# EAGLE design audio_amp (EAGLE 9.1.3)
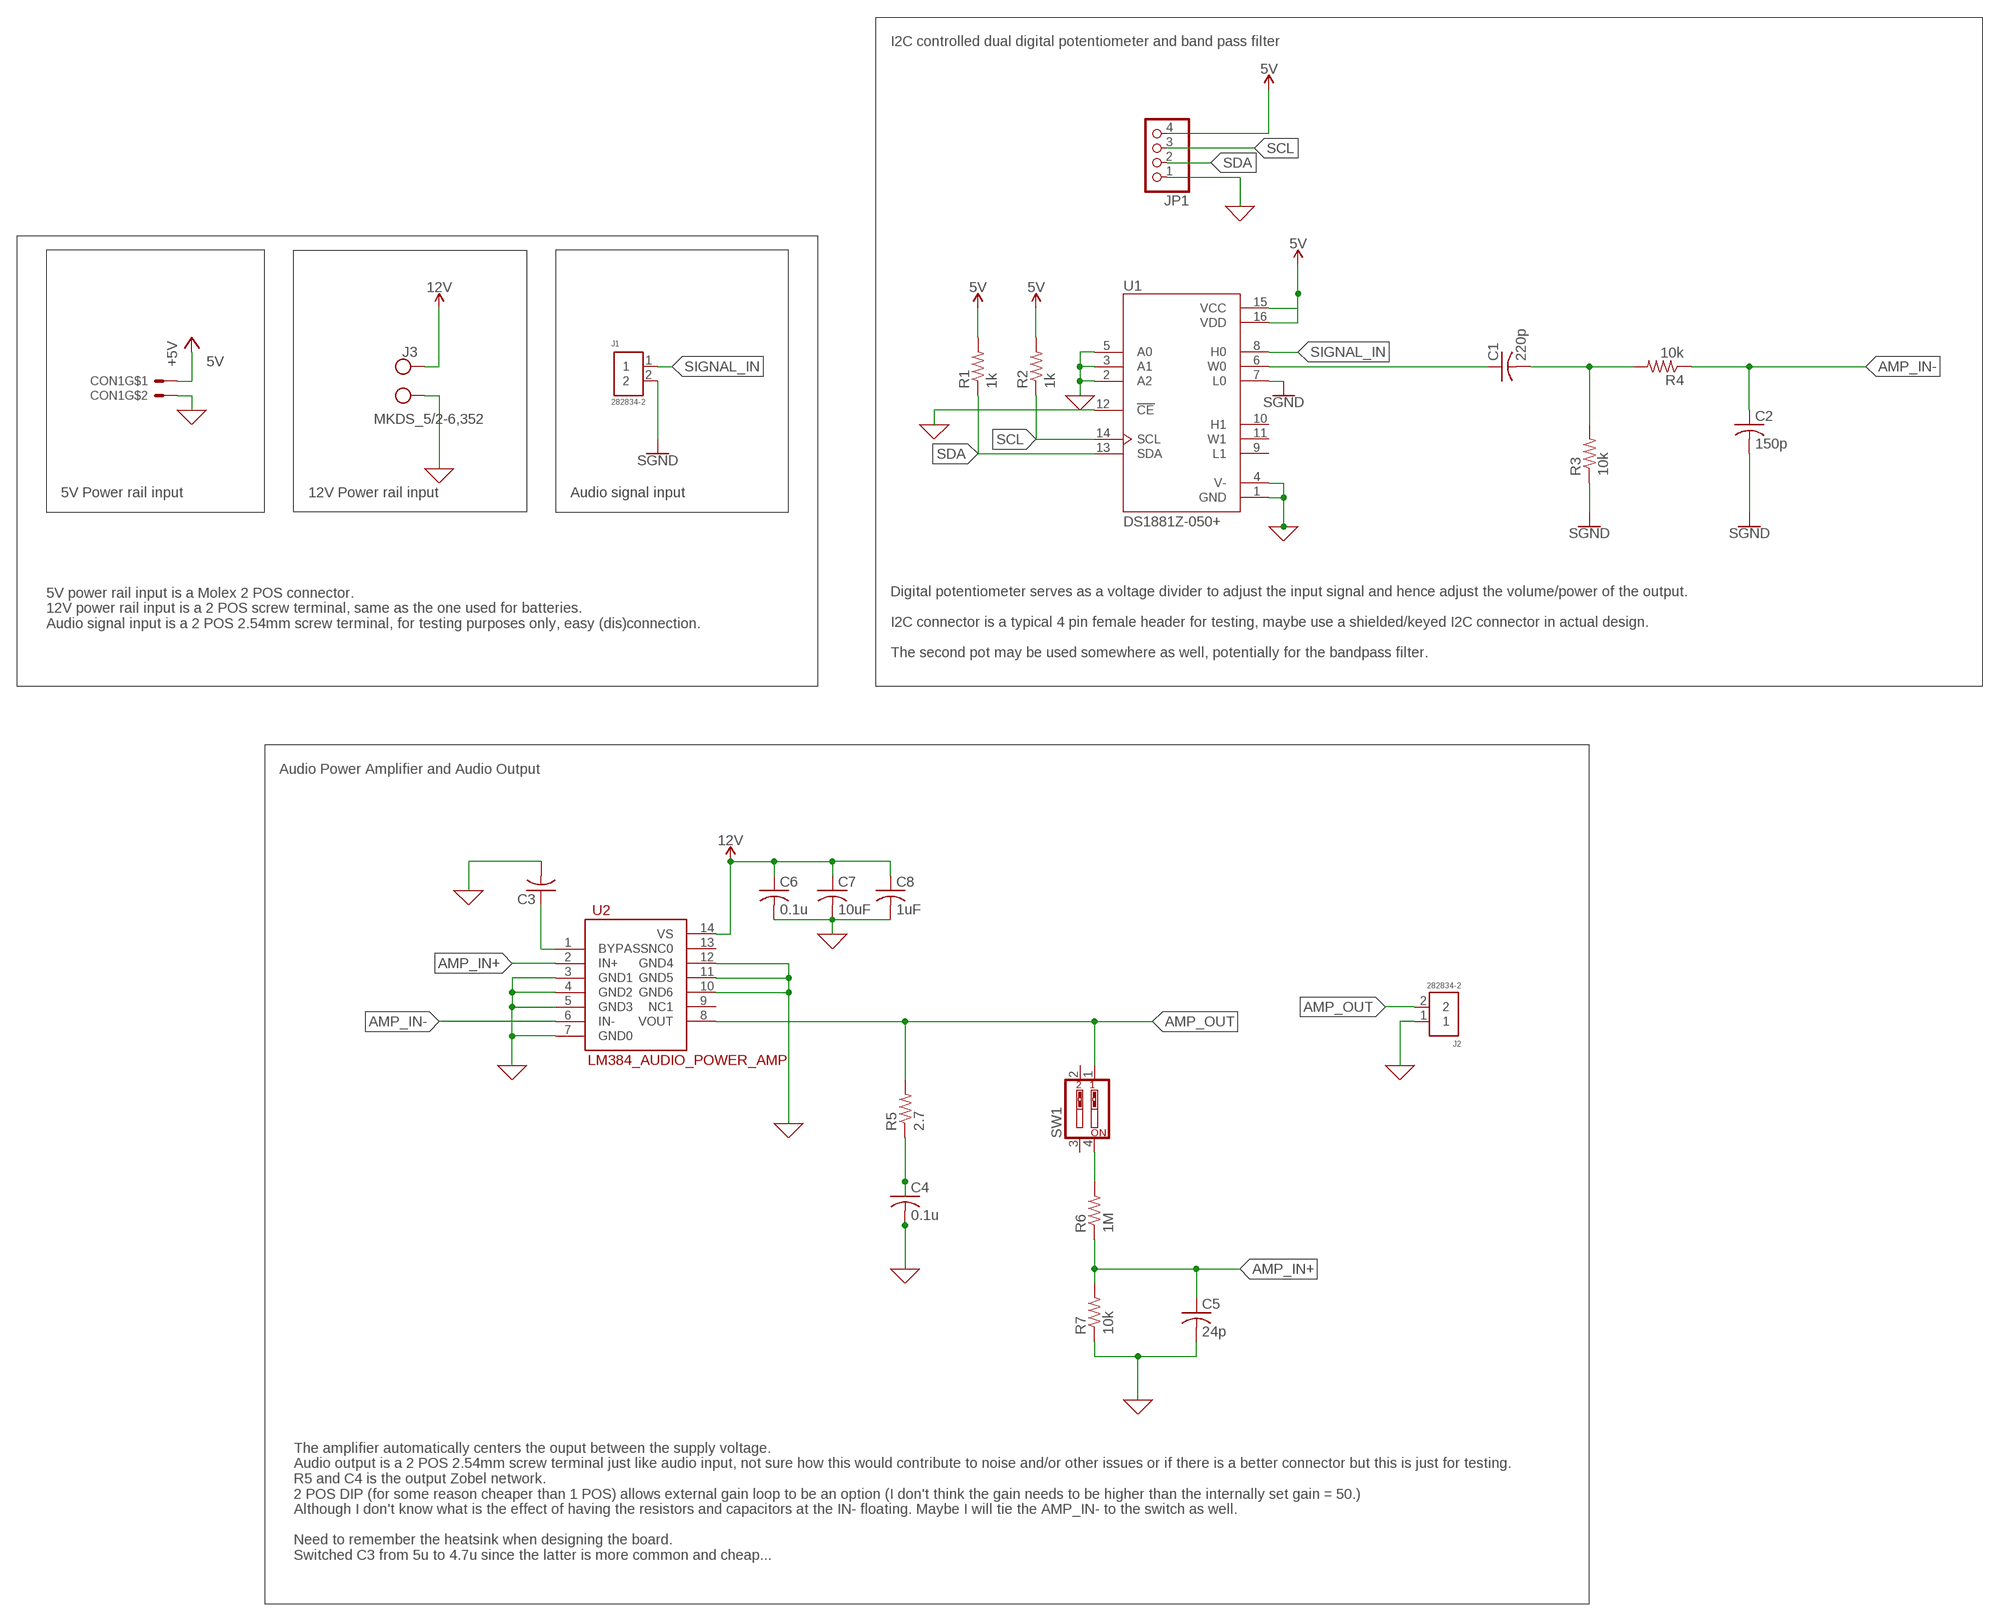
[diagram p0: schematic, sheet 1]

## Parts
C1  220p  FKP2G002201D00JSSD  [CAP7.2MM*4.5MM]
C2  150p  FKP2G002201D00JSSD  [CAP7.2MM*4.5MM]
C3  C-USC0805  [C0805]
C4  0.1u  C-USC0805  [C0805]
C5  24p  C-USC0805  [C0805]
C6  0.1u  C-USC0805  [C0805]
C7  10uF  C-USC1206  [C1206]
C8  1uF  C-USC1206  [C1206]
CON1  MOLEX_5566-2  [5566-2]
J1  282834-2  [2P_SCREW_TERM]
J2  282834-2  [2P_SCREW_TERM]
J3  MKDS_5/2-6,352  [MKDS_5/2-6,35]
JP1  PINHD-1X4  [1X04]
R1  1k  R-US_R1206  [R1206]
R2  1k  R-US_R1206  [R1206]
R3  10k  R-US_R0805  [R0805]
R4  10k  R-US_R0805  [R0805]
R5  2.7  R-US_R1206  [R1206]
R6  1M  R-US_R0805  [R0805]
R7  10k  R-US_R0805  [R0805]
SW1  SW_DIP-2  [EDG-02]
U1  DS1881Z-050+  [16-SOIC]
U2  LM384_AUDIO_POWER_AMP  [DIP14]

## Nets
0: C3.2 C4.2 C5.2 C6.2 C7.2 C8.2 CON1.2 J2.1 J3.1(KL) JP1.1 R7.1 U1.1(GND) U1.2(A2) U1.3(A1) U1.4(V-) U1.5(A0) U1.12(!CE) U2.3(GND1) U2.4(GND2) U2.5(GND3) U2.7(GND0) U2.10(GND6) U2.11(GND5) U2.12(GND4) ; supply symbol labelled GND
5V: CON1.1 JP1.4 R1.2 R2.2 U1.15(VCC) U1.16(VDD) ; supply symbol labelled +5V
12V: C6.1 C7.1 C8.1 J3.2(KL1) U2.14(VS)
AMP_IN+: C5.1 R6.1 R7.2 U2.2(IN+)
AMP_IN-: C2.P$1 R4.1 U2.6(IN-)
AMP_OUT: J2.2 R5.2 SW1.1 U2.8(VOUT)
GND: C2.P$2 J1.2 R3.1 U1.7(L0) ; supply symbol labelled SGND
N$1: C1.P$2 R3.2 R4.2
N$2: C3.1 U2.1(BYPASS)
N$3: C4.1 R5.1
N$4: R6.2 SW1.4
SCL: JP1.3 R2.1 U1.14(SCL)
SDA: JP1.2 R1.1 U1.13(SDA)
SIGNAL_IN: J1.1 U1.8(H0)
SIGNAL_OUT: C1.P$1 U1.6(W0)
Unconnected: SW1.2 SW1.3 U1.9(L1) U1.10(H1) U1.11(W1) U2.9(NC1) U2.13(NC0)

## Notes on the sheet
- I2C controlled dual digital potentiometer and band pass filter
- 5V Power rail input | 12V Power rail input | Audio signal input
- 5V power rail input is a Molex 2 POS connector.
  12V power rail input is a 2 POS screw terminal, same as the one used for batteries.
  Audio signal input is a 2 POS 2.54mm screw terminal, for testing purposes only, easy (dis)connection.
- Digital potentiometer serves as a voltage divider to adjust the input signal and hence adjust the volume/power of the output.
  
  I2C connector is a typical 4 pin female header for testing, maybe use a shielded/keyed I2C connector in actual design.
  
  The second pot may be used somewhere as well, potentially for the bandpass filter.
- Audio Power Amplifier and Audio Output
- The amplifier automatically centers the ouput between the supply voltage. 
  Audio output is a 2 POS 2.54mm screw terminal just like audio input, not sure how this would contribute to noise and/or other issues or if there is a better connector but this is just for testing. 
  R5 and C4 is the output Zobel network.
  2 POS DIP (for some reason cheaper than 1 POS) allows external gain loop to be an option (I don't think the gain needs to be higher than the internally set gain = 50.) 
  Although I don't know what is the effect of having the resistors and capacitors at the IN- floating. Maybe I will tie the AMP_IN- to the switch as well.
  
  Need to remember the heatsink when designing the board. 
  Switched C3 from 5u to 4.7u since the latter is more common and cheap...

## Library data of the parts
C1 C2 = Ultrasonic Audio Amp:FKP2G002201D00JSSD: 220pF Film Capacitor 220V 400V Polypropylene (PP) Radial
C3-C8 = adafruit:C-US: CAPACITOR, American symbol
CON1 = ARVP:MOLEX_5566-2
J1 J2 = Ultrasonic Audio Amp:282834-2: Terminal block; 2.54mm; angled 90°; 0.03÷1mm2; ways: 2; 10A; H: 10mm; CENTERLINE_PITCH: 2.54 mm[.1 in]; COMMENT: 282834-2; DESCRIPTION: Wire-To-Board Terminal Block, 2, 150 V, 10 A, 30 Awg, 16 Awg, 1.4 Mm; DIGI-KEY_PART_NUMBER: A98333-ND; DIGIKEY-PURCHASE-URL: https://snapeda.com/shop?store=DigiKey&id=431057; EU_ROHS_COMPLIANCE: Compliant with Exemptions; MF: TE Connectivity; MP: 282834-2; NUMBER_OF_POSITIONS: 2; PACKAGE: None
J3 = Moira:MKDS_5/2-6,35: CONN TERM BLOCK 2POS 6.35MM PCB, 2 Position Wire to Board Terminal Block Horizontal with Board 0.250" (6.35mm) Through Hole, Phoenix Contact (1714955), Digikey:277-1269-ND, MKDS 5/2-6,35 package adpated from Eagle library package MKDS 5/3-6,35
JP1 = pinhead:PINHD-1X4: PIN HEADER
R1-R4 R6 R7 = resistor:R-US_: RESISTOR, American symbol
R5 = adafruit:R-US_: RESISTOR, American symbol
SW1 = special:SW_DIP-2: DIP SWITCH
U1 = Ultrasonic Audio Amp:DS1881Z-050+: Digital Potentiometers, Semiconductors and Actives; DESCRIPTION: Digital Potentiometer 45k Ohm 2 Circuit 64 Taps I²C Interface 16-SO; DIGI-KEY_PART_NUMBER: DS1881Z-050+T&R-ND; DIGIKEY-PURCHASE-URL: https://snapeda.com/shop?store=DigiKey&id=473256; MF: Maxim Integrated; MP: DS1881Z-050+; PACKAGE: SOIC-16 Maxim
U2 = Ultrasonic Audio Amp:LM384_AUDIO_POWER_AMP: IC AMP CLASS AB MONO 5.5W 14DIP

## Board
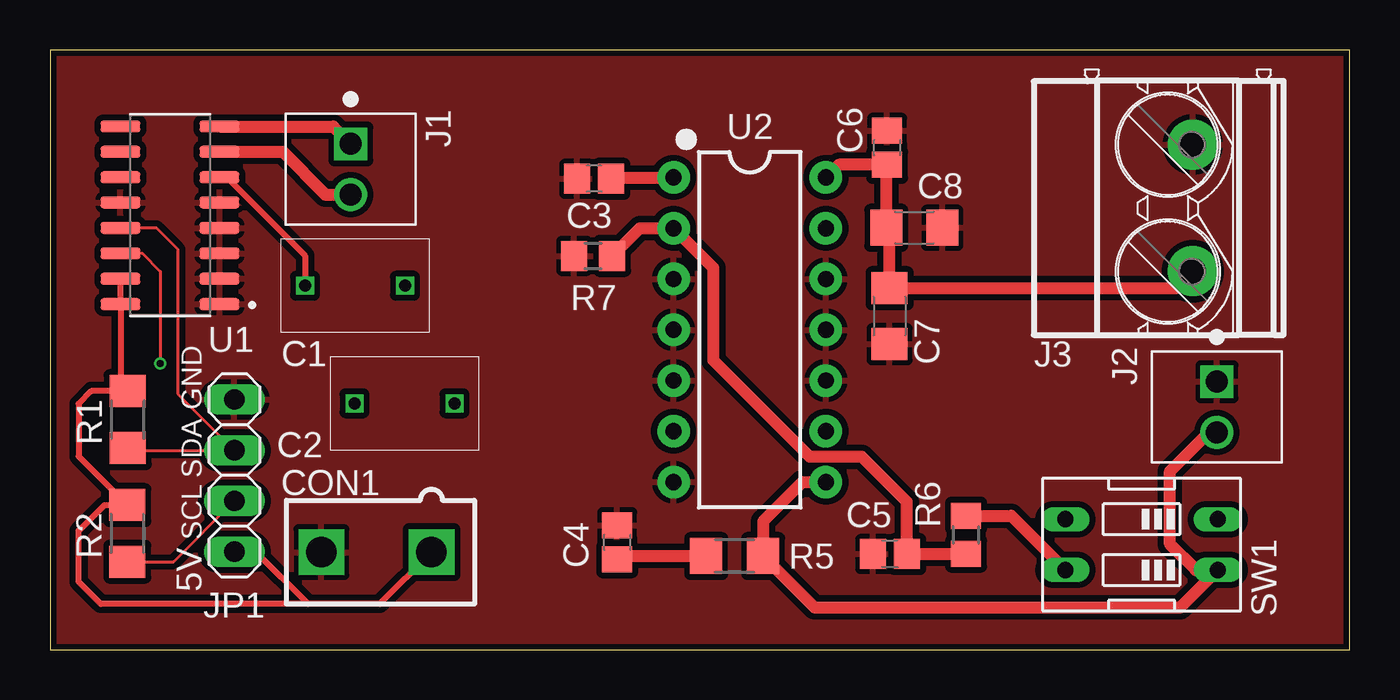
[diagram p1: board, top side]
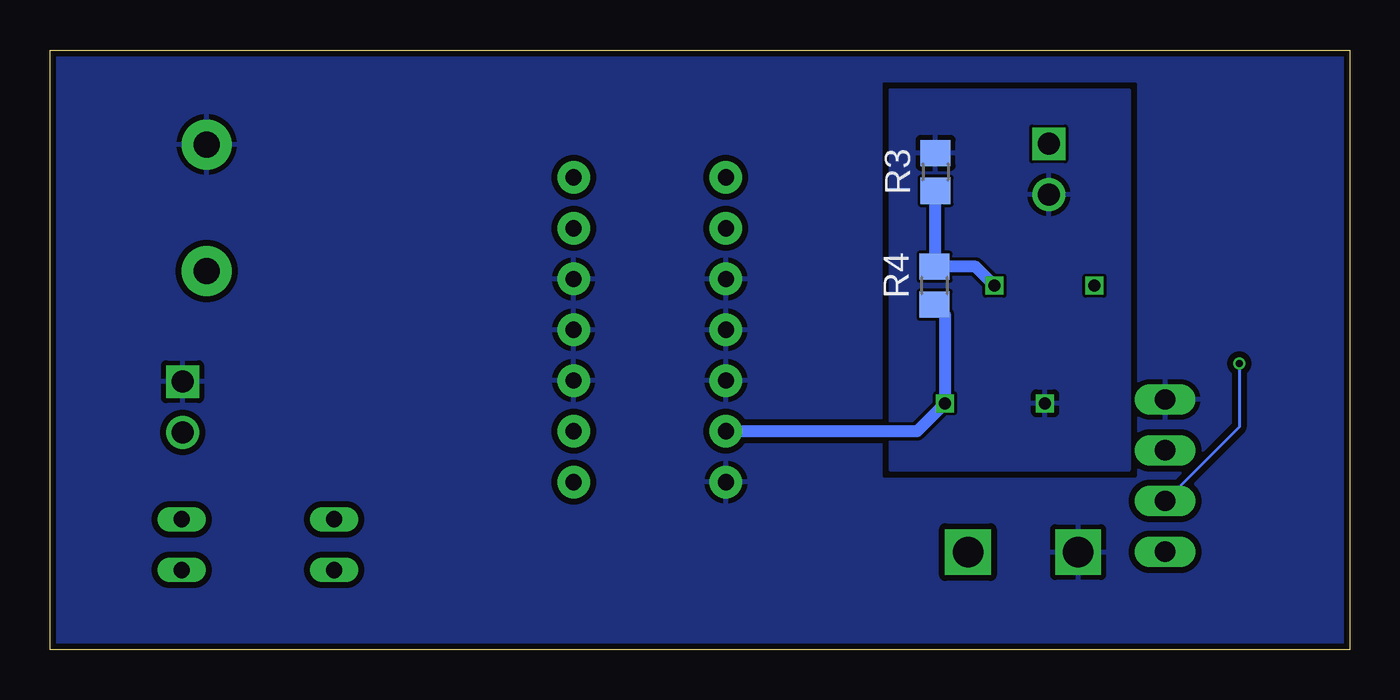
[diagram p2: board, bottom side, seen from below]

Size 65 x 30 mm. Coordinates in mm from the lower left corner, seen from the top.
Outline: 0,0 65,0 65,30 0,30 0,0
Copper layers (1*16): Top 0.035mm / dielectric 1.5mm / Bottom 0.035mm
Design rules "OSHPark2Layer": minimum track width 6mil, minimum drill 10mil, track to track 6mil, track to pad 6mil, pad to pad 6mil, via to via 6mil, smd to smd 0mil, copper to edge 10mil, drill to drill 10mil, minimum pad ring 5mil, minimum via ring 5mil, stop-mask expansion 2mil, vias tented up to drill 100mil, thermal gap 10mil

### Footprints (pad centres in the part's own frame; a part is rotated, then mirrored left to right if it is on the bottom)
CAP7.2MM*4.5MM = drill 0.6 square: P$1 2.35,1.2; P$2 2.35,6.2
C0805 = smd 1.3 x 1.5: 1 -0.85,0; 2 0.85,0
C1206 = smd 1.6 x 1.8: 1 -1.4,0; 2 1.4,0
5566-2 = drill 1.524 square: 1 0,-2.756; 2 0,2.756
2P_SCREW_TERM = drill 1.1 square: 1 -1.27,0 | drill 1.1: 2 1.27,0
MKDS_5/2-6,35 = drill 1.3 pad 2.5: 1 -3.175,0; 2 3.175,0
1X04 = drill 1.016 long: 1 -3.81,0; 2 -1.27,0; 3 1.27,0; 4 3.81,0
R1206 = smd 1.6 x 1.803: 1 -1.422,0; 2 1.422,0
R0805 = smd 1.3 x 1.5: 1 -0.95,0; 2 0.95,0
EDG-02 = drill 0.813 long: 1 -1.27,-3.81; 2 1.27,-3.81; 3 1.27,3.81; 4 -1.27,3.81
16-SOIC = smd 1.97 x 0.59: 1 -2.475,4.445; 2 -2.475,3.175; 3 -2.475,1.905; 4 -2.475,0.635; 5 -2.475,-0.635; 6 -2.475,-1.905; 7 -2.475,-3.175; 8 -2.475,-4.445; 9 2.475,-4.445; 10 2.475,-3.175; 11 2.475,-1.905; 12 2.475,-0.635; 13 2.475,0.635; 14 2.475,1.905; 15 2.475,3.175; 16 2.475,4.445
DIP14 = drill 0.813 pad 1.626: 1 -7.62,-3.81; 2 -5.08,-3.81; 3 -2.54,-3.81; 4 0,-3.81; 5 2.54,-3.81; 6 5.08,-3.81; 7 7.62,-3.81; 8 7.62,3.81; 9 5.08,3.81; 10 2.54,3.81; 11 0,3.81; 12 -2.54,3.81; 13 -5.08,3.81; 14 -7.62,3.81

### Placement (x,y rotation side)
C1  11.56,20.56 270 top
C2  21.43,9.97 90 top
C3  27.22,23.56 180 top
C4  28.37,5.36 90 top
C5  42.02,4.78 180 top
C6  41.87,25.11 90 top
C7  42,16.68 270 top
C8  43.24,21.11 0 top
CON1  16.33,4.87 90 top
J1  15.04,24.03 270 top
J2  58.37,12.13 270 top
J3  57.16,22.1 270 top
JP1  9.22,8.7 270 top
R1  3.89,11.51 90 top
R2  3.87,5.81 90 top
R3  20.71,23.9 270 bottom
R4  20.76,18.21 90 bottom
R5  34.24,4.68 0 top
R6  45.82,5.74 90 top
R7  27.17,19.7 0 top
SW1  54.6,5.25 90 top
U1  6,21.73 180 top
U2  35,16 270 top

### Tracks (layer width: path | path; a pad name or v marks a point on that pad's centre or on a via)
0
  pour Bottom (isolate 0.3, rank 2): 0,0 0,30 65,30 65,0
  pour Top (isolate 0.305): 0.16,0.02 0.16,30.07 64.93,30.07 64.93,0.02
5V
  Top 0.305: 12.9,2.28 16.5,2.28 CON1.1 | 12.9,2.28 2.55,2.28 1.43,3.4 1.43,5.94 2.73,7.24 R2.2 1.43,9.67 1.43,12.29 2.07,12.93 R1.2 3.53,13.29 U1.16 U1.15 | 12.9,2.28 10.29,4.89 JP1.4
12V
  Top 0.61: C8.1 41.84,21.18 | 41.84,21.18 41.84,24.22 C6.1 39.45,24.26 U2.14 | 41.84,21.18 42,21.02 C7.1 56.32,18.08 J3.2
AMP_IN+
  Top 0.61: R6.1 45.81,4.78 C5.1 42.86,4.79 42.86,7.4 40.61,9.65 38,9.65 33.18,14.47 33.18,19.09 U2.2 29.5,21.08 R7.2
AMP_IN-
  Bottom 0.61: U2.6 21.63,10.92 C2.P$1 20.23,13.18 20.23,16.73 R4.1
AMP_OUT
  Top 0.61: U2.8 37.64,8.38 36.19,6.93 35.66,6.4 R5.2 38.24,2.1 56.53,2.1 SW1.1 57.31,3.98 56.02,5.27 56.02,8.91 57.97,10.86 J2.2
GND
  Top 0.61: U1.7 11.62,24.91 13.77,22.76 J1.2
  pour Bottom: 11,28 23,28 23,9 11,9
N$1
  Bottom 0.61: C1.P$2 18.71,19.16 R4.2 20.71,19.21 R3.2
N$2
  Top 0.61: C3.1 28.13,23.62 U2.1
N$3
  Top 0.61: C4.1 28.54,4.68 R5.1
N$4
  Top 0.61: R6.2 48.08,6.69 SW1.4
SCL  (via drill 0.35)
  Top 0.152: U1.14 4.61,19.83 5.52,18.92 v5.52,14.32 | R2.1 6.18,4.39 JP1.3
  Bottom 0.152: v5.52,14.32 5.52,11.14 JP1.3
SDA
  Top 0.152: U1.13 5.32,21.09 6.39,20.03 6.39,12.79 9.2,9.97 JP1.2 4,9.97 R1.1
SIGNAL_IN
  Top 0.61: U1.8 14.16,26.17 J1.1
SIGNAL_OUT
  Top 0.305: C1.P$1 12.76,19.7 8.83,23.63 U1.6

### Text on the board
tNames: GND | SDA | SCL | 5V
Document: Heatsink Keepout